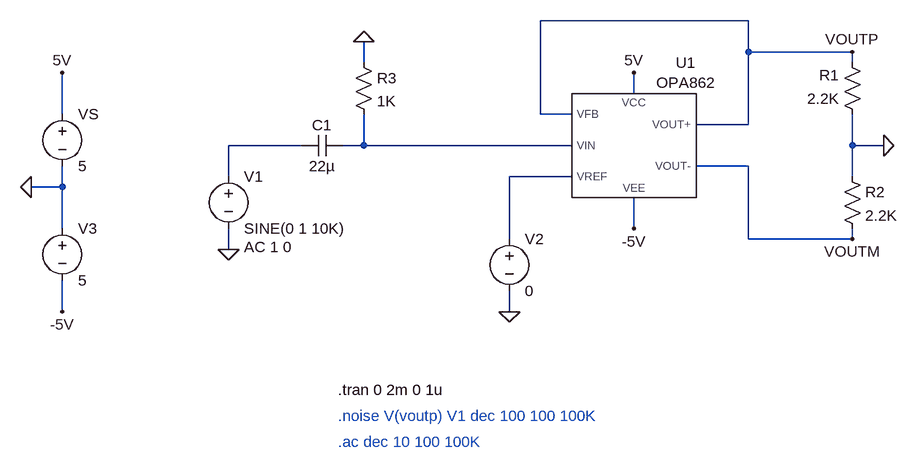
[diagram p0: schematic Draft11.asc]
Draft11.asc, the LTspice schematic file:
Version 4
SHEET 1 880 852
WIRE 400 -16 80 -16
WIRE 400 32 400 -16
WIRE 560 32 400 32
WIRE -192 48 -192 16
WIRE 560 48 560 32
WIRE 224 96 224 64
WIRE -656 128 -656 64
WIRE 80 128 80 -16
WIRE 128 128 80 128
WIRE 400 144 400 32
WIRE 400 144 320 144
WIRE -288 176 -400 176
WIRE -192 176 -192 128
WIRE -192 176 -224 176
WIRE 128 176 -192 176
WIRE 560 176 560 128
WIRE 608 176 560 176
WIRE 400 208 320 208
WIRE -400 224 -400 176
WIRE 128 224 32 224
WIRE 560 224 560 176
WIRE -656 240 -656 208
WIRE -656 240 -704 240
WIRE -656 304 -656 240
WIRE 224 304 224 256
WIRE 32 320 32 224
WIRE 400 320 400 208
WIRE 560 320 560 304
WIRE 560 320 400 320
WIRE -400 336 -400 304
WIRE -656 432 -656 384
WIRE 32 432 32 400
FLAG 32 432 0
FLAG -400 336 0
FLAG -704 240 0
FLAG -656 64 5V
FLAG 224 64 5V
FLAG 608 176 0
FLAG -656 432 -5V
FLAG 224 304 -5V
FLAG 560 32 VOUTP
FLAG 560 320 VOUTM
FLAG -192 16 0
SYMBOL OPA862 224 176 R0
SYMATTR InstName U1
SYMBOL voltage -400 208 R0
WINDOW 123 24 124 Left 2
WINDOW 39 0 0 Left 0
SYMATTR InstName V1
SYMATTR Value SINE(0 1 10K)
SYMATTR Value2 AC 1 0
SYMBOL voltage 32 304 R0
WINDOW 123 0 0 Left 0
WINDOW 39 0 0 Left 0
SYMATTR InstName V2
SYMATTR Value 0
SYMBOL voltage -656 112 R0
WINDOW 123 0 0 Left 0
WINDOW 39 0 0 Left 0
SYMATTR InstName VS
SYMATTR Value 5
SYMBOL res 576 144 R180
WINDOW 0 36 76 Left 2
WINDOW 3 36 40 Left 2
SYMATTR InstName R1
SYMATTR Value 2.2K
SYMBOL res 544 208 R0
SYMATTR InstName R2
SYMATTR Value 2.2K
SYMBOL voltage -656 288 R0
SYMATTR InstName V3
SYMATTR Value 5
SYMBOL cap -224 160 R90
WINDOW 0 0 32 VBottom 2
WINDOW 3 32 32 VTop 2
SYMATTR InstName C1
SYMATTR Value 22µ
SYMBOL res -208 32 R0
SYMATTR InstName R3
SYMATTR Value 1K
TEXT -232 552 Left 2 !.tran 0 2m 0 1u
TEXT -232 592 Left 2 ;.noise V(voutp) V1 dec 100 100 100K
TEXT -232 632 Left 2 ;.ac dec 10 100 100K

The netlist it stands for:
* Draft11.asc
XU1 N002 VOUTP VOUTP VOUTM N003 5V -5V OPA862  ; pins VIN VFB VOUT+ VOUT- VREF VCC VEE
V1 N001 0 SINE(0 1 10K) AC 1 0
V2 N003 0 0
VS 5V 0 5
R1 0 VOUTP 2.2K
R2 0 VOUTM 2.2K
V3 0 -5V 5
C1 N002 N001 22µ
R3 0 N002 1K
.tran 0 2m 0 1u
* .noise V(voutp) V1 dec 100 100 100K
* .ac dec 10 100 100K
.lib D:\git-repos\LTSpice-Projects\opa862\opa862_a.lib
.backanno
.end